# EAGLE design anemometer-r3 (EAGLE 9.2.2)
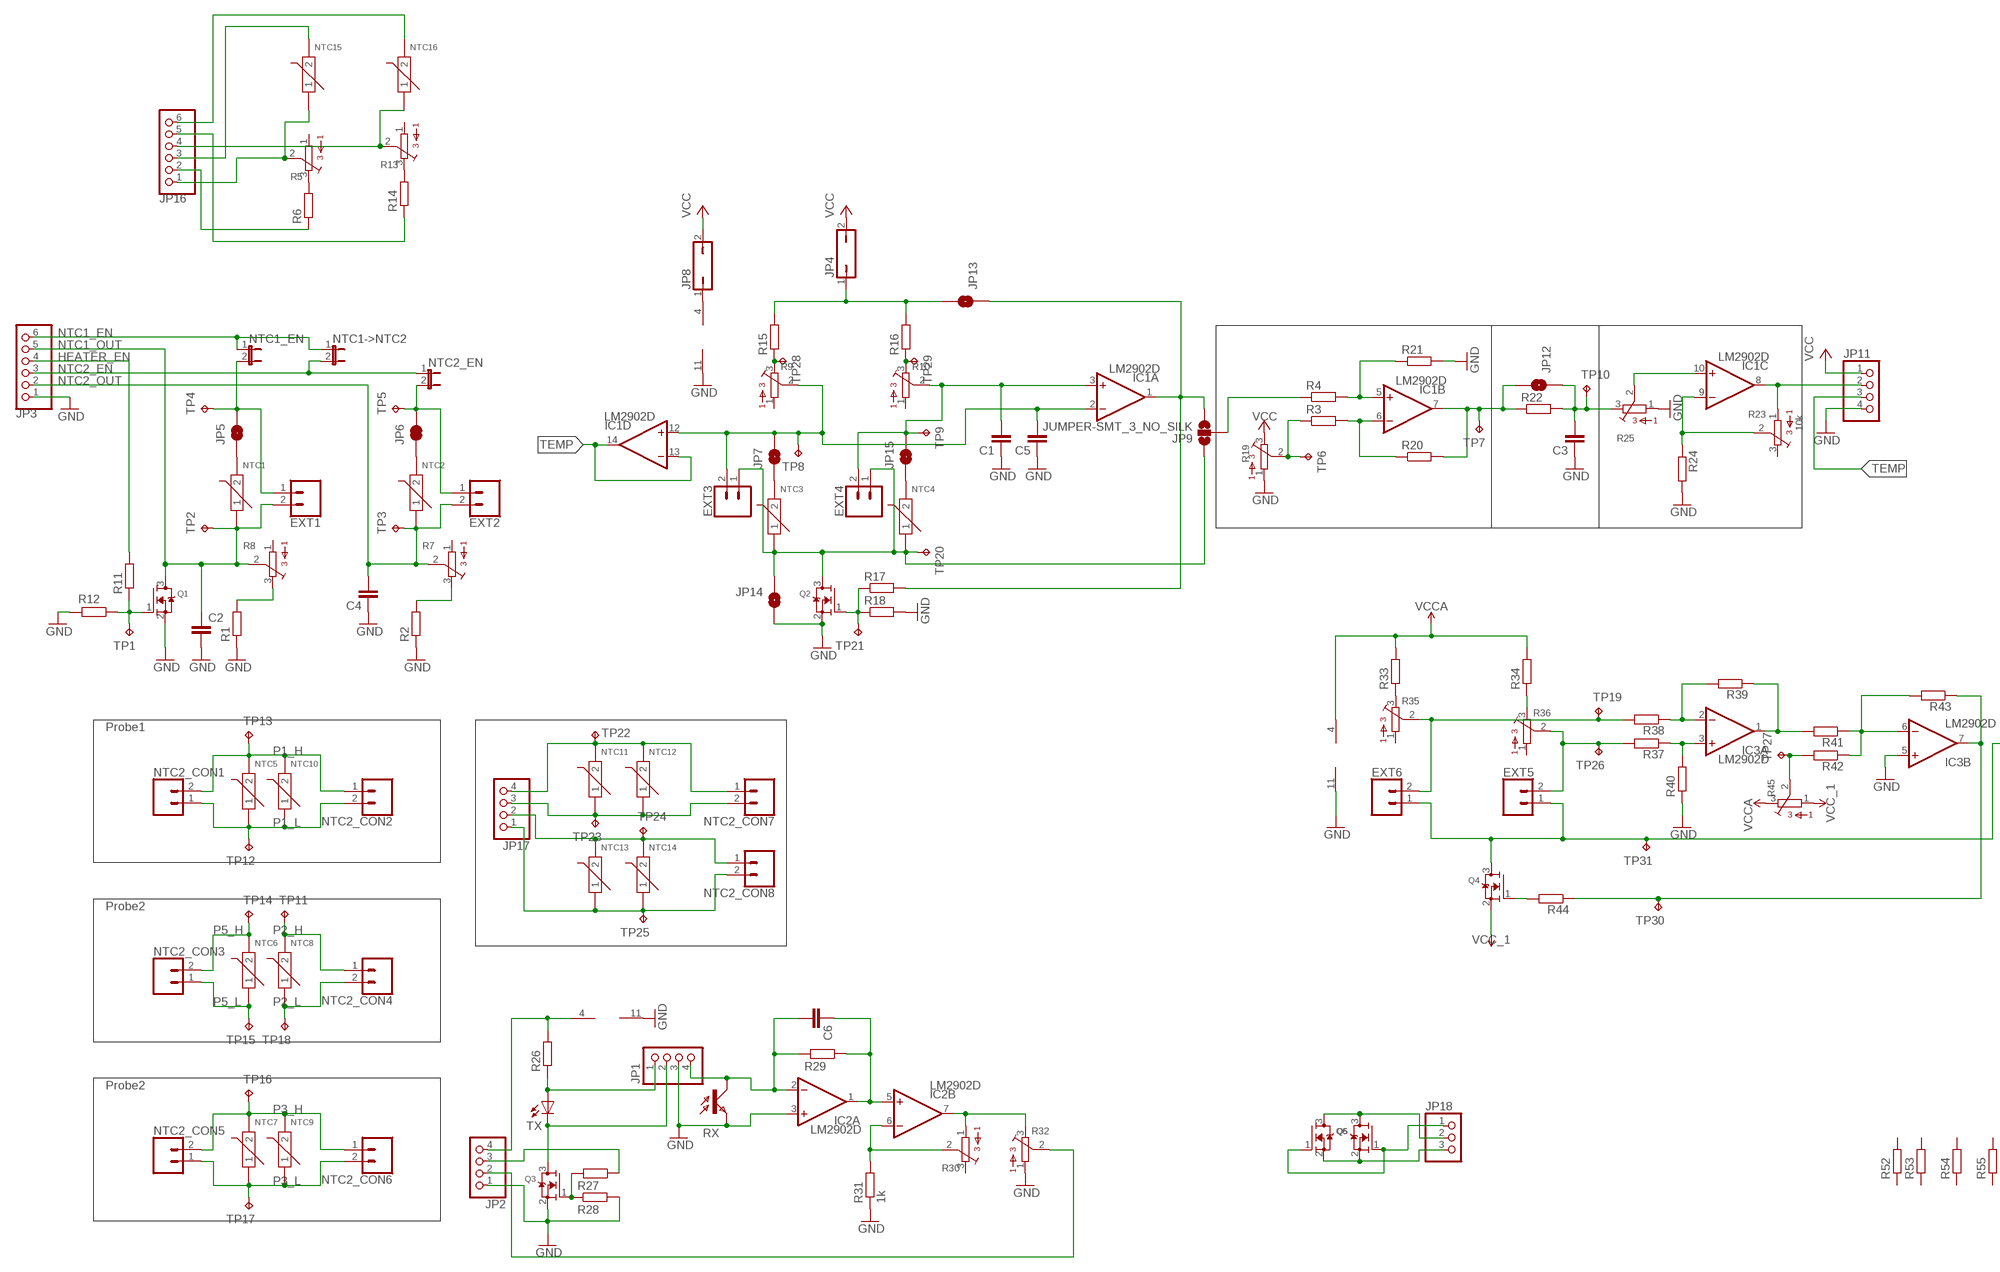
[diagram p0: schematic, sheet 1, part 1 of 2]
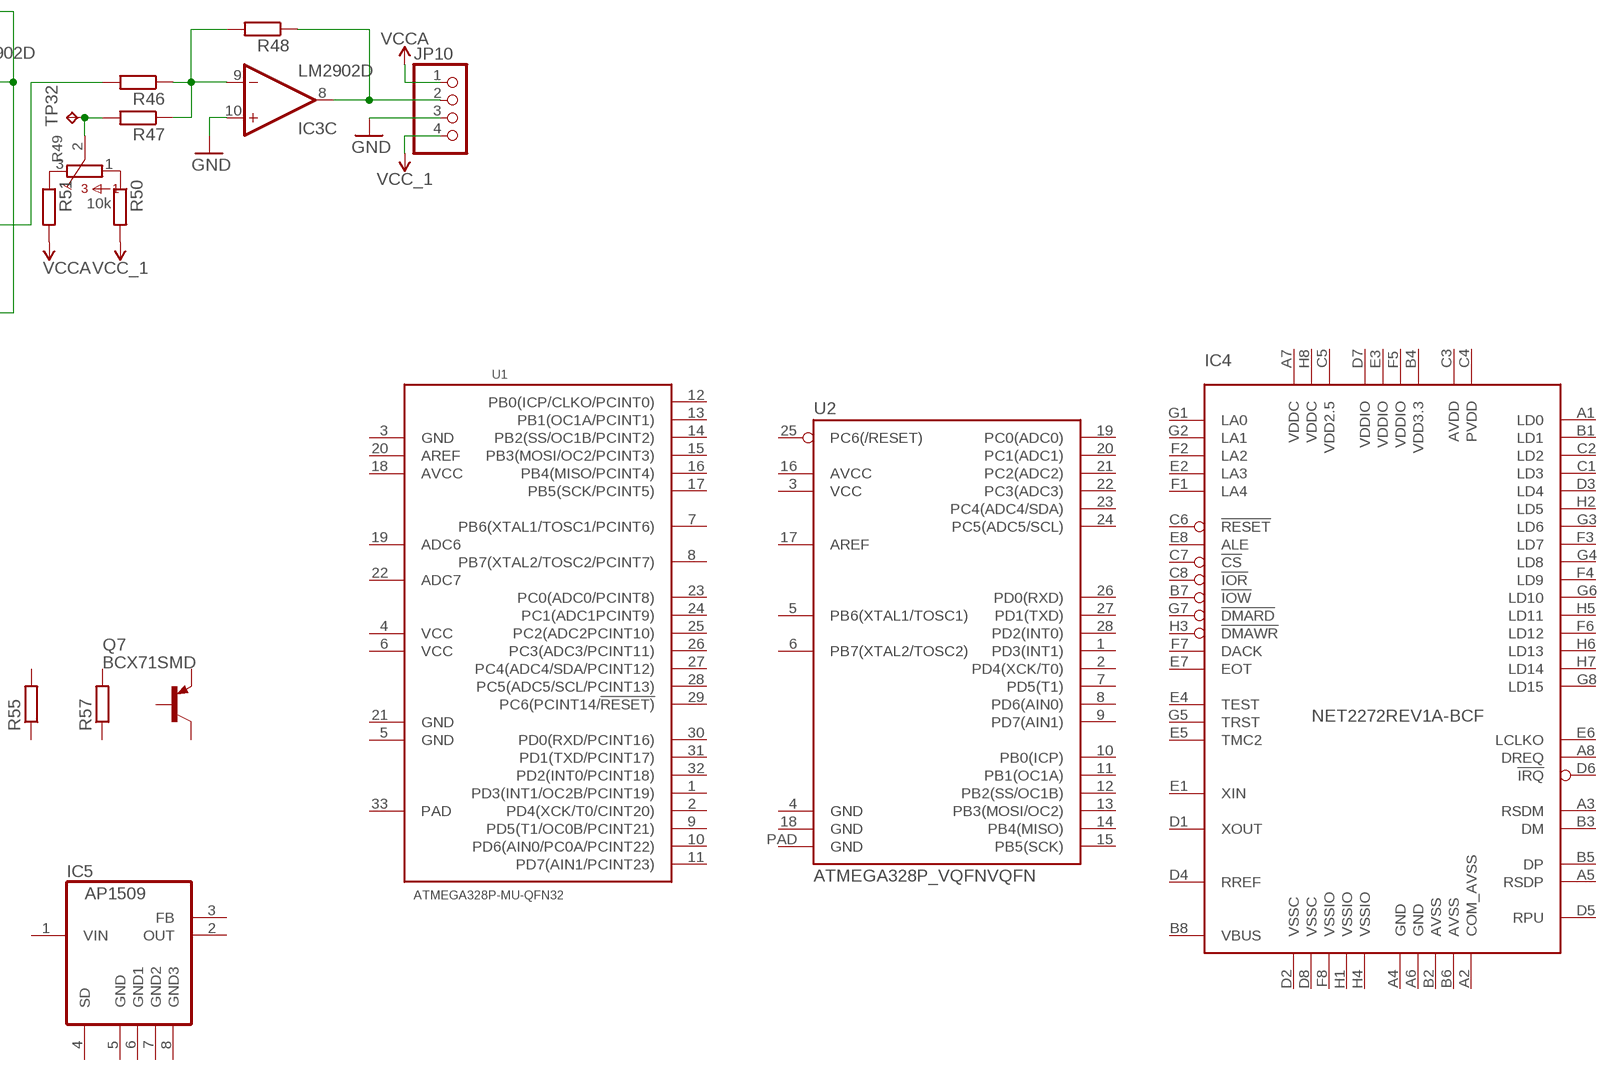
[diagram p1: schematic, sheet 1, part 2 of 2]

## Parts
C1  C-EUC0603  [C0603]
C2  C-EUC0603  [C0603]
C3  C-EUC0603  [C0603]
C4  C-EUC0603  [C0603]
C5  C-EUC0603  [C0603]
C6  C-EUC0603  [C0603]
EXT1  CONN_02  [1X02]
EXT2  CONN_02  [1X02]
EXT3  CONN_02  [1X02]
EXT4  CONN_02  [1X02]
EXT5  CONN_02  [1X02]
EXT6  CONN_02  [1X02]
IC1  LM2902D  [SO14]
IC2  LM2902D  [SO14]
IC3  LM2902D  [SO14]
IC4  NET2272REV1A-BCF  [FBGA64]
IC5  AP1509SOIC-8-TIGHT  [SO08-H]
JP1  PINHD-1X4  [1X04]
JP2  PINHD-1X4  [1X04]
JP3  PINHD-1X6  [1X06]
JP4  JP1Q  [JP1]
JP5  JUMPER-SMT_2_NC_TRACE_SILK  [SMT-JUMPER_2_NC_TRACE_SILK]
JP6  JUMPER-SMT_2_NC_TRACE_SILK  [SMT-JUMPER_2_NC_TRACE_SILK]
JP7  JUMPER-SMT_2_NC_TRACE_SILK  [SMT-JUMPER_2_NC_TRACE_SILK]
JP8  JP1Q  [JP1]
JP9  JUMPER-SMT_3_NO_SILK  [SMT-JUMPER_3_NO_SILK]
JP10  PINHD-1X4  [1X04]
JP11  PINHD-1X4  [1X04]
JP12  JUMPER-SMT_2_NO_SILK  [SMT-JUMPER_2_NO_SILK]
JP13  JUMPER-SMT_2_NO_SILK  [SMT-JUMPER_2_NO_SILK]
JP14  JUMPER-SMT_2_NO_SILK  [SMT-JUMPER_2_NO_SILK]
JP15  JUMPER-SMT_2_NC_TRACE_SILK  [SMT-JUMPER_2_NC_TRACE_SILK]
JP16  PINHD-1X6  [1X06]
JP17  PINHD-1X4  [1X04]
JP18  PINHD-1X3  [1X03]
NTC1  NCP18WF104F03RC  THERMISTOR-RES-NTC-100K(0603)  [R0603]
NTC1->NTC2  JP1E  [JP1]
NTC1_EN  JP1E  [JP1]
NTC2  NCP18WF104F03RC  THERMISTOR-RES-NTC-100K(0603)  [R0603]
NTC2_CON1  CONN_02  [1X02]
NTC2_CON2  CONN_02  [1X02]
NTC2_CON3  CONN_02  [1X02]
NTC2_CON4  CONN_02  [1X02]
NTC2_CON5  CONN_02  [1X02]
NTC2_CON6  CONN_02  [1X02]
NTC2_CON7  CONN_02  [1X02]
NTC2_CON8  CONN_02  [1X02]
NTC2_EN  JP1E  [JP1]
NTC3  NCP18WF104F03RC  THERMISTOR-RES-NTC-100K(0603)  [R0603]
NTC4  NCP18WF104F03RC  THERMISTOR-RES-NTC-100K(0603)  [R0603]
NTC5  NCP18WF104F03RC  THERMISTOR-RES-NTC-100K(0603)  [R0603]
NTC6  NCP18WF104F03RC  THERMISTOR-RES-NTC-100K(0603)  [R0603]
NTC7  NCP18WF104F03RC  THERMISTOR-RES-NTC-100K(0603)  [R0603]
NTC8  NCP18WF104F03RC  THERMISTOR-RES-NTC-100K(0603)  [R0603]
NTC9  NCP18WF104F03RC  THERMISTOR-RES-NTC-100K(0603)  [R0603]
NTC10  NCP18WF104F03RC  THERMISTOR-RES-NTC-100K(0603)  [R0603]
NTC11  NCP18WF104F03RC  THERMISTOR-RES-NTC-100K(0603)  [R0603]
NTC12  NCP18WF104F03RC  THERMISTOR-RES-NTC-100K(0603)  [R0603]
NTC13  NCP18WF104F03RC  THERMISTOR-RES-NTC-100K(0603)  [R0603]
NTC14  NCP18WF104F03RC  THERMISTOR-RES-NTC-100K(0603)  [R0603]
NTC15  NCP18WF104F03RC  THERMISTOR-RES-NTC-100K(0603)  [R0603]
NTC16  NCP18WF104F03RC  THERMISTOR-RES-NTC-100K(0603)  [R0603]
Q1  MOSFET-NREFLOW  [SOT23]
Q2  MOSFET-NREFLOW  [SOT23]
Q3  MOSFET-NREFLOW  [SOT23]
Q4  MOSFET-NREFLOW  [SOT23]
Q5  MOSFET-NREFLOW  [SOT23]
Q6  MOSFET-NREFLOW  [SOT23]
Q7  BCX71SMD  [SOT23]
R1  R-EU_R0603  [R0603]
R2  R-EU_R0603  [R0603]
R3  R-EU_R0603  [R0603]
R4  R-EU_R0603  [R0603]
R5  3362P  [3362P]
R6  R-EU_R0603  [R0603]
R7  3362P  [3362P]
R8  3362P  [3362P]
R9  3362P  [3362P]
R10  3362P  [3362P]
R11  R-EU_R0603  [R0603]
R12  R-EU_R0603  [R0603]
R13  3362P  [3362P]
R14  R-EU_R0603  [R0603]
R15  R-EU_R0603  [R0603]
R16  R-EU_R0603  [R0603]
R17  R-EU_R0603  [R0603]
R18  R-EU_R0603  [R0603]
R19  3362P  [3362P]
R20  R-EU_R0603  [R0603]
R21  R-EU_R0603  [R0603]
R22  R-EU_R0603  [R0603]
R23  10k  3362P  [3362P]
R24  R-EU_R0603  [R0603]
R25  3362P  [3362P]
R26  R-EU_R0603  [R0603]
R27  R-EU_R0603  [R0603]
R28  R-EU_R0603  [R0603]
R29  R-EU_R0603  [R0603]
R30  3362P  [3362P]
R31  1k  R-EU_R0603  [R0603]
R32  3362P  [3362P]
R33  R-EU_R0603  [R0603]
R34  R-EU_R0603  [R0603]
R35  3362P  [3362P]
R36  3362P  [3362P]
R37  R-EU_R0603  [R0603]
R38  R-EU_R0603  [R0603]
R39  R-EU_R0603  [R0603]
R40  R-EU_R0603  [R0603]
R41  R-EU_R0603  [R0603]
R42  R-EU_R0603  [R0603]
R43  R-EU_R0603  [R0603]
R44  R-EU_R0603  [R0603]
R45  3362P  [3362P]
R46  R-EU_R0603  [R0603]
R47  R-EU_R0603  [R0603]
R48  R-EU_R0603  [R0603]
R49  10k  3362P  [3362P]
R50  R-EU_R0603  [R0603]
R51  R-EU_R0603  [R0603]
R52  R-EU_R0402  [R0402]
R53  R-EU_R0603  [R0603]
R54  R-EU_R0805  [R0805]
R55  R-EU_R1206  [R1206]
R57  R-EU_R2010  [R2010]
RX  LPT80A  [LPT80A]
TP1  TPTP16R  [TP16R]
TP2  TPTP16R  [TP16R]
TP3  TPTP16R  [TP16R]
TP4  TPTP16R  [TP16R]
TP5  TPTP16R  [TP16R]
TP6  TPTP16R  [TP16R]
TP7  TPTP16R  [TP16R]
TP8  TPTP16R  [TP16R]
TP9  TPTP16R  [TP16R]
TP10  TPTP16R  [TP16R]
TP11  TPTP16R  [TP16R]
TP12  TPTP16R  [TP16R]
TP13  TPTP16R  [TP16R]
TP14  TPTP16R  [TP16R]
TP15  TPTP16R  [TP16R]
TP16  TPTP16R  [TP16R]
TP17  TPTP16R  [TP16R]
TP18  TPTP16R  [TP16R]
TP19  TPTP16R  [TP16R]
TP20  TPTP16R  [TP16R]
TP21  TPTP16R  [TP16R]
TP22  TPTP16R  [TP16R]
TP23  TPTP16R  [TP16R]
TP24  TPTP16R  [TP16R]
TP25  TPTP16R  [TP16R]
TP26  TPTP16R  [TP16R]
TP27  TPTP16R  [TP16R]
TP28  TPTP16R  [TP16R]
TP29  TPTP16R  [TP16R]
TP30  TPTP16R  [TP16R]
TP31  TPTP16R  [TP16R]
TP32  TPTP16R  [TP16R]
TX  LEDIRL80A  [IRL80A]
U1  ATMEGA328P-MU-QFN32  MCU-ATMEGA328P-MU(QFN32)  [QFN32G-0.5-5X5MM]
U2  ATMEGA328P_VQFNVQFN  [VQFN-28]

## Nets
GND: C1.1 C2.2 C3.1 C4.1 C5.1 IC1.11(P:V-) IC2.3(A:+IN) IC2.11(P:V-) IC3.5(B:+IN) IC3.10(C:+IN) IC3.11(P:V-) JP1.3 JP2.1 JP3.1 JP10.3 JP11.4 JP14.2 Q1.2(S) Q2.2(S) Q3.2(S) R1.1 R2.1 R12.2 R18.2 R19.1 R21.2 R24.2 R25.1 R28.2 R31.1 R32.1 R40.1 RX.E
HEATER_EN: JP3.4 R11.2
N$1: IC1.10(C:+IN) R25.2
N$2: R9.3 R15.1 TP28.TP
N$3: R10.3 R16.1 TP29.TP
N$4: R1.2 R8.3
N$5: JP1.1 R26.1 TX.A
N$6: JP7.1 NTC3.2
N$7: Q1.1(G) R11.1 R12.1 TP1.TP
N$8: JP16.4 NTC16.1 R13.2
N$9: R2.2 R7.3
N$10: JP1.2 Q3.3(D) TX.K(C)
N$11: EXT3.1 EXT4.1 JP9.1 JP14.1 NTC3.1 NTC4.1 Q2.3(D) TP20.TP
N$12: Q2.1(G) R17.1 R18.1 TP21.TP
N$13: IC1.1(A:OUT) JP9.3 JP13.1 R17.2
N$14: IC1.5(B:+IN) R4.2 R21.1
N$15: C3.2 JP12.1 R22.2 R25.3 TP10.TP
N$16: IC1.6(B:-IN) R3.2 R20.1
N$17: R3.1 R19.2 TP6.TP
N$18: IC1.9(C:-IN) R23.2 R24.1
N$19: C5.2 EXT3.2 IC1.2(A:-IN) IC1.12(D:+IN) JP7.2 R9.2 TP8.TP
N$20: IC1.8(C:OUT) JP11.2 R23.1
N$21: C1.2 EXT4.2 IC1.3(A:+IN) JP15.2 R10.2 TP9.TP
N$22: JP5.1 NTC1.2
N$23: JP6.1 NTC2.2
N$24: IC2.4(P:V+) JP2.4 R26.2
N$25: IC1.4(P:V+) JP8.1
N$26: JP17.4 NTC2_CON7.1 NTC11.2 NTC12.2 TP22.TP
N$27: JP4.1 JP13.2 R15.2 R16.2
N$28: IC1.7(B:OUT) JP12.2 R20.2 R22.1 TP7.TP
N$29: EXT2.1 JP6.2 NTC2_EN.2 TP5.TP
N$30: JP17.3 NTC2_CON7.2 NTC11.1 NTC12.1 TP23.TP
N$31: EXT1.1 JP5.2 NTC1_EN.2 TP4.TP
N$32: JP15.1 NTC4.2
N$33: JP17.2 NTC2_CON8.1 NTC13.2 NTC14.2 TP24.TP
N$34: JP17.1 NTC2_CON8.2 NTC13.1 NTC14.1 TP25.TP
N$35: R33.1 R35.3
N$36: JP16.6 NTC16.2
N$37: JP16.3 NTC15.2
N$38: Q3.1(G) R27.2 R28.1
N$39: JP2.3 R27.1
N$40: R5.3 R6.2
N$41: R13.3 R14.2
N$42: JP16.1 NTC15.1 R5.2
N$43: C6.1 IC2.1(A:OUT) IC2.5(B:+IN) R29.1
N$44: JP16.2 R6.1
N$45: JP16.5 R14.1
N$46: C6.2 IC2.2(A:-IN) JP1.4 R29.2 RX.C
N$47: IC2.6(B:-IN) R30.2 R31.2
N$48: IC2.7(B:OUT) R30.1 R32.3
N$49: JP2.2 R32.2
N$50: R34.1 R36.3
N$51: JP9.2 R4.1
N$52: EXT6.2 R35.2 R38.2 TP19.TP
N$53: EXT5.2 R36.2 R37.2 TP26.TP
N$54: EXT5.1 EXT6.1 Q4.3(D) R46.2 TP31.TP
N$55: IC3.3(A:+IN) R37.1 R40.2
N$56: IC3.2(A:-IN) R38.1 R39.2
N$57: IC3.6(B:-IN) R41.1 R42.1 R43.2
N$58: IC3.1(A:OUT) R39.1 R41.2
N$59: Q4.1(G) R44.2
N$60: IC3.7(B:OUT) R43.1 R44.1 TP30.TP
N$61: R49.1 R50.1
N$62: R42.2 R45.2 TP27.TP
N$63: IC3.9(C:-IN) R46.1 R47.1 R48.2
N$64: R49.3 R51.1
N$65: JP18.2 Q5.3(D) Q6.3(D)
N$66: R47.2 R49.2 TP32.TP
N$67: IC3.8(C:OUT) JP10.2 R48.1
N$68: JP18.3 Q5.2(S) Q6.2(S)
N$69: JP18.1 Q5.1(G) Q6.1(G)
NTC1_EN: JP3.6 NTC1->NTC2.1 NTC1_EN.1
NTC1_OUT: C2.1 EXT1.2 JP3.5 NTC1.1 Q1.3(D) R8.2 TP2.TP
NTC2_EN: JP3.3 NTC1->NTC2.2 NTC2_EN.1
NTC2_OUT: C4.2 EXT2.2 JP3.2 NTC2.1 R7.2 TP3.TP
P1_H: NTC2_CON1.2 NTC2_CON2.1 NTC5.2 NTC10.2 TP13.TP
P1_L: NTC2_CON1.1 NTC2_CON2.2 NTC5.1 NTC10.1 TP12.TP
P2_H: NTC2_CON4.1 NTC8.2 TP11.TP
P2_L: NTC2_CON4.2 NTC8.1 TP18.TP
P3_H: NTC2_CON5.2 NTC2_CON6.1 NTC7.2 NTC9.2 TP16.TP
P3_L: NTC2_CON5.1 NTC2_CON6.2 NTC7.1 NTC9.1 TP17.TP
P5_H: NTC2_CON3.2 NTC6.2 TP14.TP
P5_L: NTC2_CON3.1 NTC6.1 TP15.TP
TEMP: IC1.13(D:-IN) IC1.14(D:OUT) JP11.3
VCC: JP4.2 JP8.2 JP11.1 R19.3
VCC_1: JP10.4 Q4.2(S) R45.1 R50.2
VCCA: IC3.4(P:V+) JP10.1 R33.2 R34.2 R45.3 R51.2
Unconnected: IC2.8(C:OUT) IC2.9(C:-IN) IC2.10(C:+IN) IC2.12(D:+IN) IC2.13(D:-IN) IC2.14(D:OUT) IC3.12(D:+IN) IC3.13(D:-IN) IC3.14(D:OUT) IC4.A1(LD0) IC4.A3(RSDM) IC4.A5(RSDP) IC4.A8(DREQ) IC4.B1(LD1) IC4.B3(DM) IC4.B5(DP) IC4.B7(!IOW) IC4.B8(VBUS) IC4.C1(LD3) IC4.C2(LD2) IC4.C6(!RESET) IC4.C7(!CS) IC4.C8(!IOR) IC4.D1(XOUT) IC4.D3(LD4) IC4.D4(RREF) IC4.D5(RPU) IC4.D6(!IRQ) IC4.E1(XIN) IC4.E2(LA3) IC4.E4(TEST) IC4.E5(TMC2) IC4.E6(LCLKO) IC4.E7(EOT) IC4.E8(ALE) IC4.F1(LA4) IC4.F2(LA2) IC4.F3(LD7) IC4.F4(LD9) IC4.F6(LD12) IC4.F7(DACK) IC4.G1(LA0) IC4.G2(LA1) IC4.G3(LD6) IC4.G4(LD8) IC4.G5(TRST) IC4.G6(LD10) IC4.G7(!DMARD) IC4.G8(LD15) IC4.H2(LD5) IC4.H3(!DMAWR) IC4.H5(LD11) IC4.H6(LD13) IC4.H7(LD14) IC5.1(VIN) IC5.4(SD) IC5.6(GND1) IC5.7(GND2) Q7.1(B) Q7.2(E) Q7.3(C) R5.1 R7.1 R8.1 R9.1 R10.1 R13.1 R23.3 R30.3 R35.1 R36.1 R52.1 R52.2 R53.1 R53.2 R54.1 R54.2 R55.1 R55.2 R57.1 R57.2 U1.1(PD3(INT1/OC2B/PCINT19)) U1.2(PD4(XCK/T0/CINT20)) U1.3(GND) U1.4(VCC) U1.5(GND) U1.6(VCC) U1.7(PB6(XTAL1/TOSC1/PCINT6)) U1.8(PB7(XTAL2/TOSC2/PCINT7)) U1.9(PD5(T1/OC0B/PCINT21)) U1.10(PD6(AIN0/PC0A/PCINT22)) U1.11(PD7(AIN1/PCINT23)) U1.12(PB0(ICP/CLKO/PCINT0)) U1.13(PB1(OC1A/PCINT1)) U1.14(PB2(SS/OC1B/PCINT2)) U1.15(PB3(MOSI/OC2/PCINT3)) U1.16(PB4(MISO/PCINT4)) U1.17(PB5(SCK/PCINT5)) U1.18(AVCC) U1.19(ADC6) U1.20(AREF) U1.21(GND) U1.22(ADC7) U1.23(PC0(ADC0/PCINT8)) U1.24(PC1(ADC1PCINT9)) U1.25(PC2(ADC2PCINT10)) U1.26(PC3(ADC3/PCINT11)) U1.27(PC4(ADC4/SDA/PCINT12)) U1.28(PC5(ADC5/SCL/PCINT13)) U1.29(PC6(PCINT14/!RESET)) U1.30(PD0(RXD/PCINT16)) U1.31(PD1(TXD/PCINT17)) U1.32(PD2(INT0/PCINT18)) U1.33(PAD) U2.1(PD3(INT1)) U2.2(PD4(XCK/T0)) U2.3(VCC) U2.4(GND) U2.5(PB6(XTAL1/TOSC1)) U2.6(PB7(XTAL2/TOSC2)) U2.7(PD5(T1)) U2.8(PD6(AIN0)) U2.9(PD7(AIN1)) U2.10(PB0(ICP)) U2.11(PB1(OC1A)) U2.12(PB2(SS/OC1B)) U2.13(PB3(MOSI/OC2)) U2.14(PB4(MISO)) U2.15(PB5(SCK)) U2.16(AVCC) U2.17(AREF) U2.18(GND) U2.19(PC0(ADC0)) U2.20(PC1(ADC1)) U2.21(PC2(ADC2)) U2.22(PC3(ADC3)) U2.23(PC4(ADC4/SDA)) U2.24(PC5(ADC5/SCL)) U2.25(PC6(/RESET)) U2.26(PD0(RXD)) U2.27(PD1(TXD)) U2.28(PD2(INT0)) U2.PAD(GND)

## Notes on the sheet
- Probe1
- Probe2
- Probe2

## Power pins joined to a net without a drawn wire
AVDD: IC4.C3(AVDD)
AVSS: IC4.B2(AVSS) IC4.B6(AVSS)
COM_AVSS: IC4.A2(COM_AVSS)
FB: IC5.3(FB)
GND: IC4.A4(GND) IC4.A6(GND) IC5.5(GND)
GND3: IC5.8(GND3)
OUT: IC5.2(OUT)
PVDD: IC4.C4(PVDD)
VDD2.5: IC4.C5(VDD2.5)
VDD3.3: IC4.B4(VDD3.3)
VDDC: IC4.A7(VDDC) IC4.H8(VDDC)
VDDIO: IC4.D7(VDDIO) IC4.E3(VDDIO) IC4.F5(VDDIO)
VSSC: IC4.D2(VSSC) IC4.D8(VSSC)
VSSIO: IC4.F8(VSSIO) IC4.H1(VSSIO) IC4.H4(VSSIO)

## Library data of the parts
C1-C6 = rcl:C-EU: CAPACITOR, European symbol; SPICEPREFIX: C
EXT1-EXT6 NTC2_CON1-NTC2_CON8 = SparkFun-Connectors:CONN_02: Multi connection point. Often used as Generic Header-pin footprint for 0.1 inch spaced/style header connections On any of the 0.1 inch spaced packages, you can populate with these: Break Away Headers - Straight <https://www.sparkfun.com/products/116> (PRT-00116) Break Away Male Headers - Right Angle <https://www.sparkfun.com/products/553> (PRT-00553) Female Headers <https://www.sparkfun.com/products/115> (PRT-00115) Break Away Headers - Machine Pin <https://www.sparkfun.com/products/117> (PRT-00117) Break Away Female Headers - Swiss Machine Pin <https://www.sparkfun.com/products/743> (PRT-00743) For SCREWTERMINALS and SPRING TERMINALS visit here: Screw Terimnals on SparkFun.com <https://www.sparkfun.com/search/results?term=Screw+Terminals> (5mm/3.5mm/2.54mm spacing) This device is also useful as a general connection point to wire up your design to another part of your project. Our various solder wires solder well into these plated through hole pads. Hook-Up Wire - Assortment (Stranded, 22 AWG) <https://www.sparkfun.com/products/11375> (PRT-11375) Hook-Up Wire - Assortment (Solid Core, 22 AWG) <https://www.sparkfun.com/products/11367> (PRT-11367) View the entire wire category on our website here <https://www.sparkfun.com/categories/141> Special notes: Molex polarized connector foot print use with: PRT-08233 with associated crimp pins and housings. 2.54_SCREWTERM for use with PRT-10571. 3.5mm Screw Terminal footprints for PRT-08084 5mm Screw Terminal footprints for use with PRT-08432
IC1-IC3 = linear:LM2902: Low power quad operational amplifier Source: Data sgeet <http://www.st.com/internet/com/TECHNICAL_RESOURCES/TECHNICAL_LITERATURE/DATASHEET/CD00000533.pdf>
IC4 = plxtech:NET2272: NET2272 USB 2.0 Peripheral Controller Source: http://www.plxtech.com/dts/download.asp?f=NET2000/2272/Net2272.spec.re040615.pdf FBGA-Type: http://www1.plxtech.com/TEMP/77131/NET2272r1A_data_book_v1.92_31Oct05.pdf; OC_FARNELL: unknown; OC_NEWARK: unknown
IC5 = BeagleBone_Blue_R3:AP1509: 150KHz, 2A PWM BUCK DC/DC CONVERTER
JP1 JP2 JP10 JP11 JP17 = pinhead:PINHD-1X4: PIN HEADER
JP3 JP16 = adafruit:PINHD-1X6: PIN HEADER
JP4 JP8 = jumper:JP1Q: JUMPER
JP5-JP7 JP15 = SparkFun-Jumpers:JUMPER-SMT_2_NC_TRACE: Normally closed trace jumper This jumper has a trace between two pads so it's normally closed (NC). Use a razor knife to open the connection. For best results follow the IPC guidelines for cutting traces: Cutout at least 0.063 mm (0.005 in). Remove all loose material to clean up the cut area. Seal the cut with an approved epoxy. Reapply solder to reclose the connection.
JP9 = SparkFun-Jumpers:JUMPER-SMT_3_NO: Normally open jumper This jumper has three pads in close proximity to each other. Apply solder to close the connection(s).
JP12-JP14 = SparkFun-Jumpers:JUMPER-SMT_2_NO: Normally open jumper This jumper has two pads in close proximity to each other. Apply solder to close the connection. Round pads are easier to solder for beginners, but are a lot larger. SparkFun Product that uses the round pads: SparkFun EL Sequencer <https://www.sparkfun.com/products/12781>
JP18 = adafruit:PINHD-1X3: PIN HEADER
NTC1-NTC16 = Seeed-Resistor:THERMISTOR-RES-NTC-100K(0603): 314110001; MPN: NCP18WF104F03RC
NTC1->NTC2 NTC1_EN NTC2_EN = jumper:JP1E: JUMPER
Q1-Q6 = adafruit:MOSFET-N: N-Channel Mosfet 2N7002E - 60V 260mA SOT23 [Digikey: 2N7002ET1GOSTR-ND] - REEL BSH103 - 30V 850mA SOT23 [Digikey: 568-5013-1-ND]
Q7 = transistor-pnp:BCX71SMD: PNP Transistor
R1-R4 R6 R11 R12 R14-R18 R20-R22 R24 R26-R29 R31 R33 R34 R37-R44 R46-R48 R50-R55 R57 = resistor:R-EU_: RESISTOR, European symbol
R5 R7-R10 R13 R19 R23 R25 R30 R32 R35 R36 R45 R49 = bourns:3362: 3362 Series 1/4" Square Trimmer
RX = opto-trans-siemens:LPT80A: PHOTO TRANSISTOR; OC_FARNELL: unknown; OC_NEWARK: unknown
TP1-TP32 = testpad:TP: Test pad
TX = adafruit:LED: LED OSRAM: - CHIPLED LG R971, LG N971, LY N971, LG Q971, LY Q971, LO R971, LY R971 LH N974, LH R974 LS Q976, LO Q976, LY Q976 LO Q996 - Hyper CHIPLED LW Q18S LB Q993, LB Q99A, LB R99A - SideLED LS A670, LO A670, LY A670, LG A670, LP A670 LB A673, LV A673, LT A673, LW A673 LH A674 LY A675 LS A676, LA A676, LO A676, LY A676, LW A676 LS A679, LY A679, LG A679 - Hyper Micro SIDELED® LS Y876, LA Y876, LO Y876, LY Y876 LT Y87S - SmartLED LW L88C, LW L88S LB L89C, LB L89S, LG L890 LS L89K, LO L89K, LY L89K LS L896, LA L896, LO L896, LY L896 - TOPLED LS T670, LO T670, LY T670, LG T670, LP T670 LSG T670, LSP T670, LSY T670, LOP T670, LYG T670 LG T671, LOG T671, LSG T671 LB T673, LV T673, LT T673, LW T673 LH T674 LS T676, LA T676, LO T676, LY T676, LB T676, LH T676, LSB T676, LW T676 LB T67C, LV T67C, LT T67C, LS T67K, LO T67K, LY T67K, LW E67C LS E67B, LA E67B, LO E67B, LY E67B, LB E67C, LV E67C, LT E67C LW T67C LS T679, LY T679, LG T679 LS T770, LO T770, LY T770, LG T770, LP T770 LB T773, LV T773, LT T773, LW T773 LH T774 LS E675, LA E675, LY E675, LS T675 LS T776, LA T776, LO T776, LY T776, LB T776 LHGB T686 LT T68C, LB T68C - Hyper Mini TOPLED® LB M676 - Mini TOPLED Santana® LG M470 LS M47K, LO M47K, LY M47K Source: http://www.osram.convergy.de/
U1 = Seeed-IC:MCU-ATMEGA328P-MU(QFN32): 310010005; MPN: ATMEGA328P-MU
U2 = SparkFun-IC-Microcontroller:ATMEGA328P_VQFN: Atmel 328P QFN part not in catalog

## Board
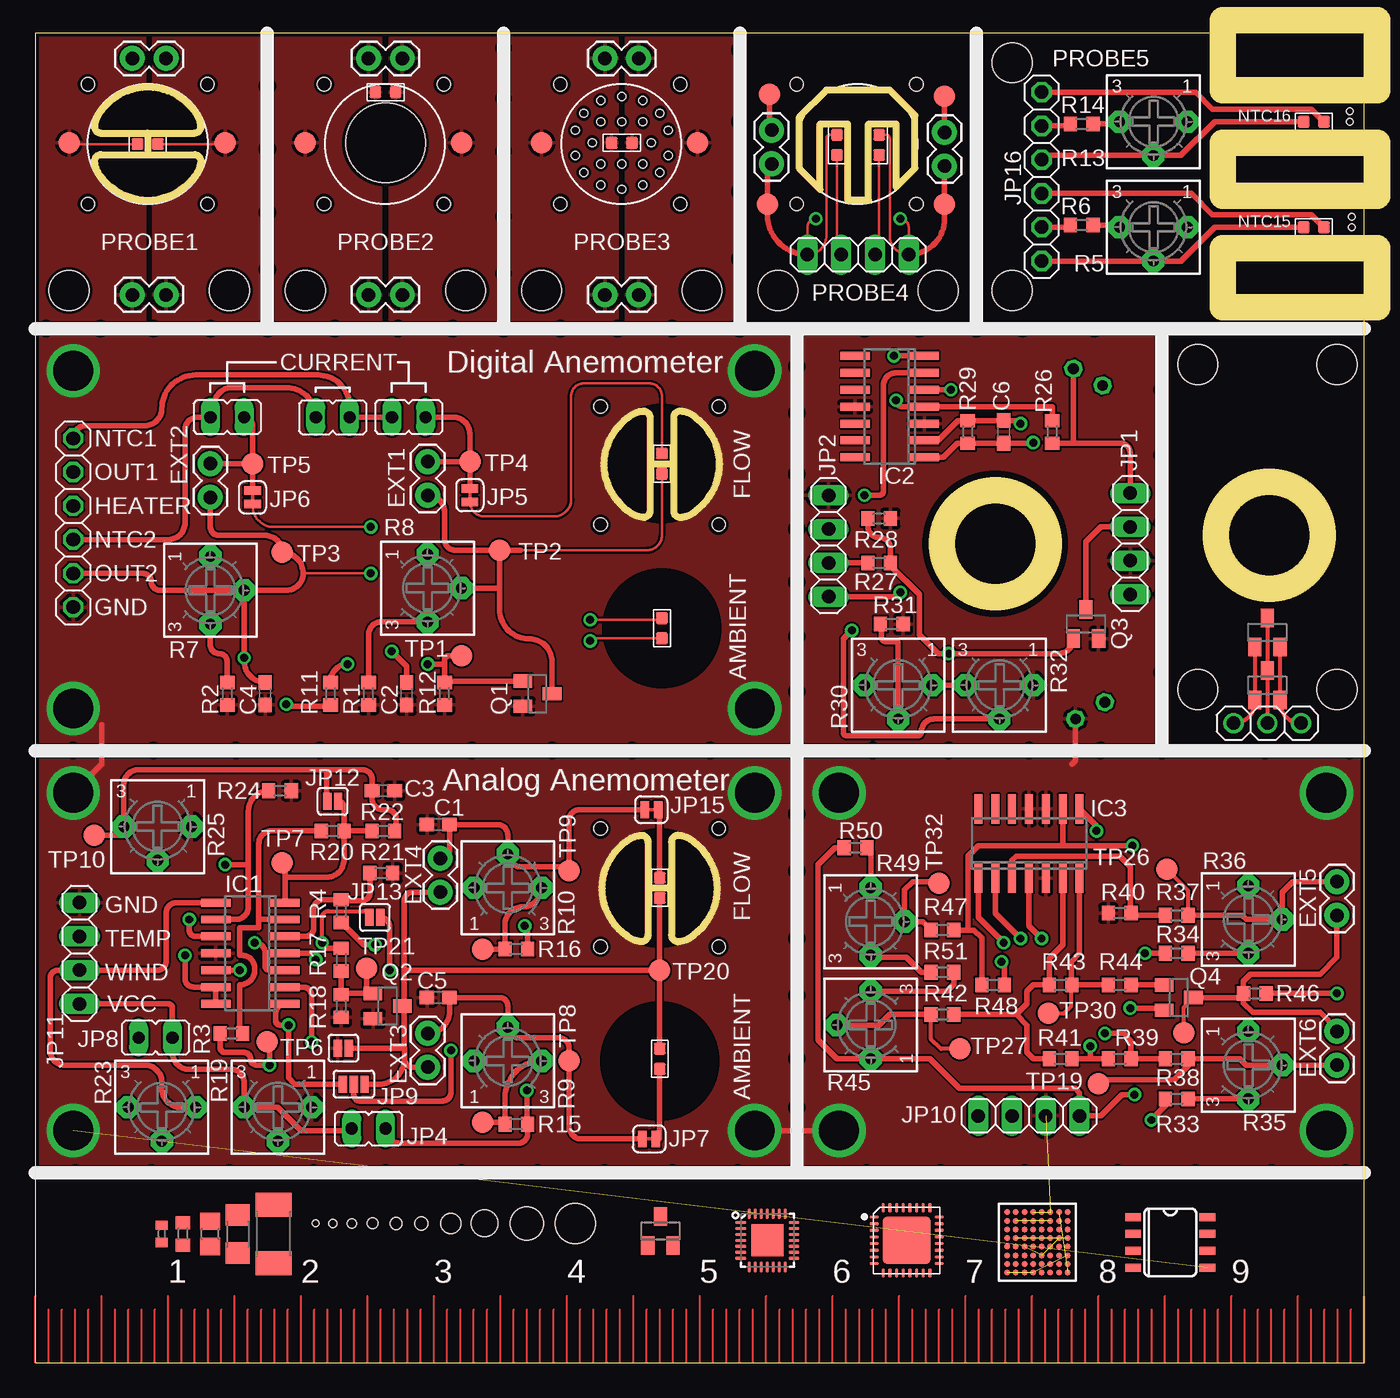
[diagram p2: board, top side]
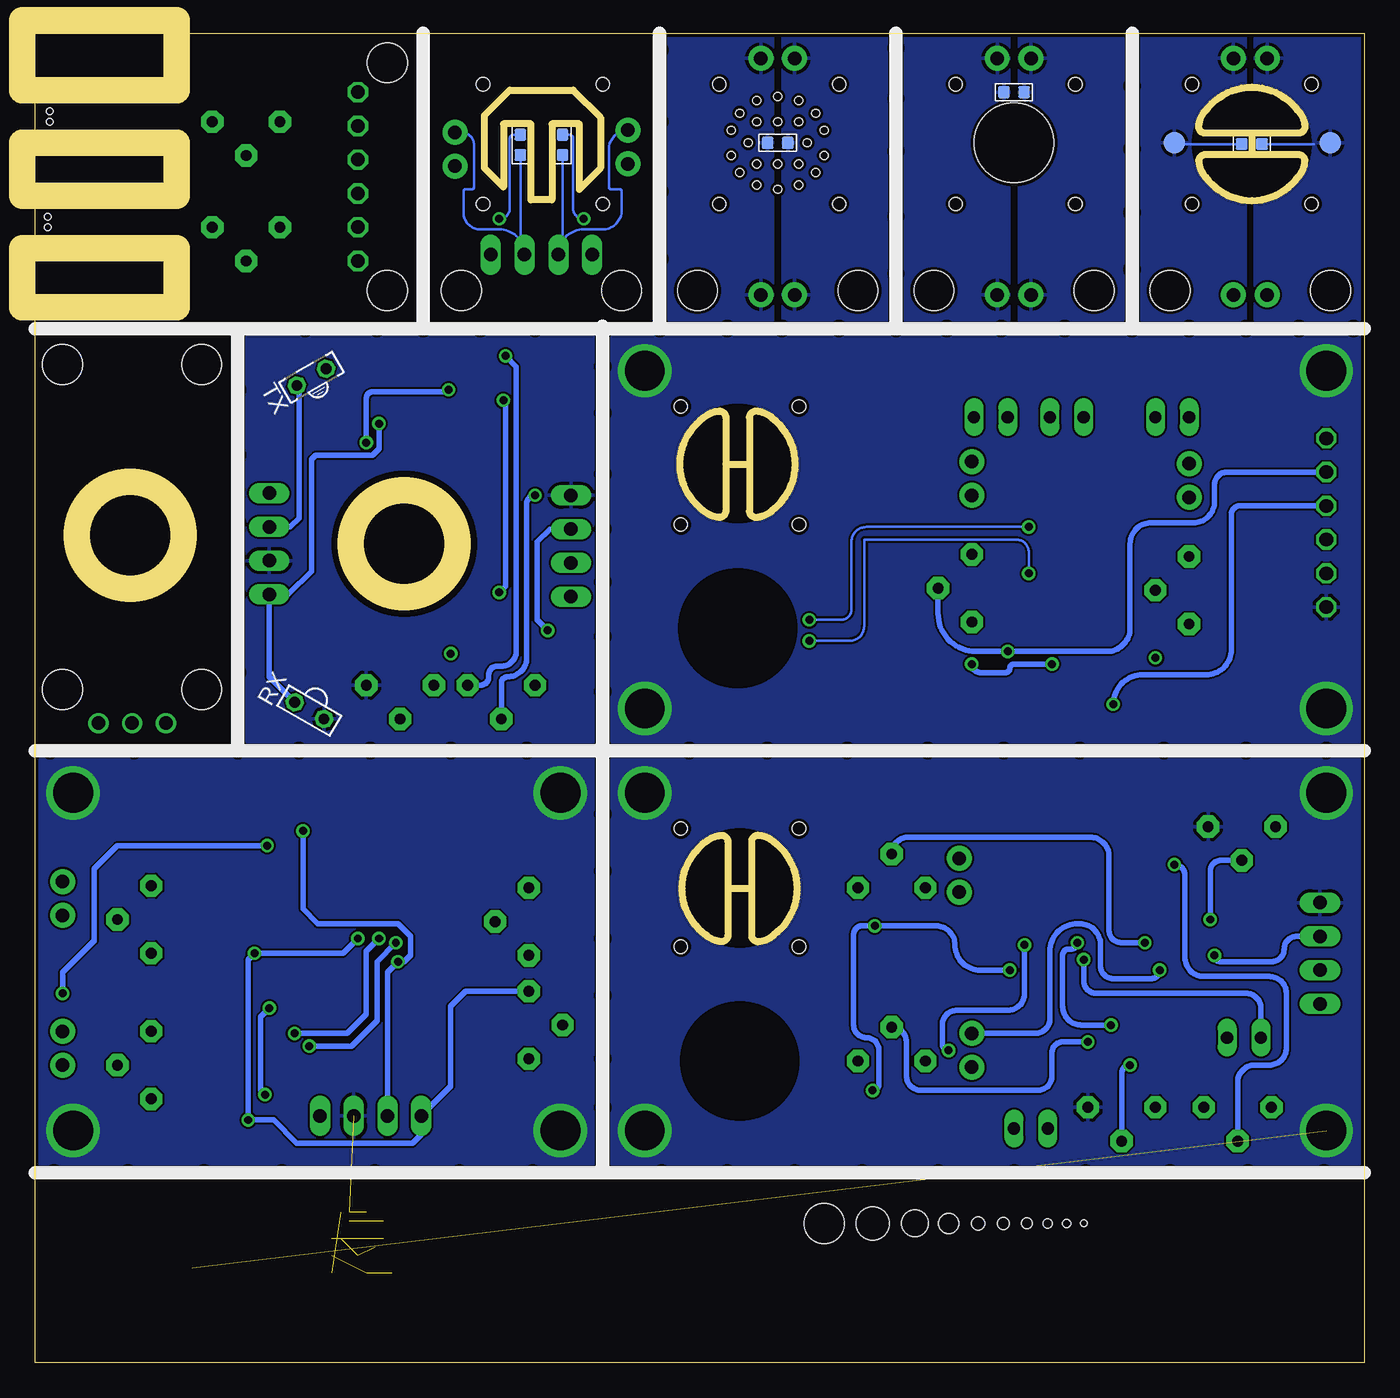
[diagram p3: board, bottom side, seen from below]

Size 100 x 100 mm. Coordinates in mm from the lower left corner, seen from the top.
Outline: 0,0 100,0 100,100 0,100 0,0
Copper layers (1*16): Top 0.035mm / dielectric 1.5mm / Bottom 0.035mm
Design rules "default *": minimum track width 6mil, minimum drill 0.35mm, track to track 6mil, track to pad 6mil, pad to pad 6mil, via to via 6mil, smd to smd 6mil, copper to edge 10mil, drill to drill 6mil, minimum pad ring 10mil, minimum via ring 8mil, stop-mask expansion 4mil, vias tented up to drill 30mil, thermal gap 10mil
Holes 1 mm at 3.96,96.17 12.96,87.17 12.96,96.17 3.96,87.17 21.74,96.17 21.74,87.17 30.74,96.17 30.74,87.17 39.52,96.17 39.52,87.17 48.52,96.17 48.52,87.17 42.54,63.03 51.43,63.03 51.43,71.92 42.54,71.92 51.43,31.29 51.43,40.17 42.54,31.29 42.54,40.17 57.3,96.17 57.3,87.17 66.3,96.17 66.3,87.17 29.05,10.48
Holes 3 mm at 2.54,80.64 14.61,80.64 20.32,80.64 32.38,80.64 38.1,80.64 50.16,80.64 55.88,80.64 67.94,80.64 73.5,97.79 73.5,80.64 87.47,75.09 97.95,75.09 87.47,50.64 97.95,50.64 40.64,10.48
Holes 6 mm at 26.35,91.76
Holes 0.6 mm at 40.64,92.71 41.91,91.76 40.64,90.81 41.27,89.53 42.55,90.17 42.55,88.58 44.13,88.27 44.13,90.17 45.72,90.17 45.72,88.58 46.99,89.53 47.62,90.81 46.35,91.76 47.62,92.71 46.99,93.98 45.72,93.34 44.13,93.34 42.55,93.34 41.27,93.98 42.55,94.93 44.13,95.25 45.72,94.93 22.38,10.48
Holes 0.5 mm at 98.9,94.14 99.06,85.41 99.06,86.2 98.9,93.34 21.11,10.48
Holes 0.8 mm at 2.86,46.04 8.89,46.04 15.08,46.04 21.43,46.04 27.15,46.04 32.86,46.04 38.89,46.04 44.93,46.04 50.8,46.04 57.31,46.04 63.02,46.04 68.74,46.04 74.77,46.04 80.17,46.04 84.77,46.04 92.55,46.04 98.9,46.04 84.77,51.91 84.77,57.78 84.77,63.18 84.77,68.26 84.77,73.18 84.77,77.79 79.69,77.79 90.96,77.79 96.36,77.79 74.3,77.79 70.8,77.79 70.8,83.03 70.8,88.27 70.8,93.66 70.8,98.9 53.02,98.74 53.02,93.34 53.02,88.11 53.02,83.03 53.02,77.79 57.31,77.79 62.39,77.79 66.52,77.79 47.94,77.79 43.81,77.79 39.53,77.79 35.24,77.79 35.24,81.92 35.24,86.2 35.24,91.12 35.24,95.09 35.24,98.9 31.43,77.79 27.3,77.79 22.54,77.79 17.46,77.79 17.46,82.23 17.46,86.52 17.46,91.28 17.46,96.04 13.18,77.79 8.89,77.79 4.92,77.79 0.79,77.79 57.31,50.48 57.31,54.61 57.31,58.74 57.31,62.71 57.31,66.83 57.31,71.44 57.31,74.93 57.31,41.27 57.31,36.99 57.31,31.91 57.31,27.62 57.31,22.86 57.31,19.21 57.31,14.29 52.86,14.29 47.94,14.29 42.86,14.29 37.78,14.29 32.07,14.29 26.35,14.29 20.95,14.29 14.61,14.29 8.73,14.29 3.02,14.29 62.55,14.29 68.1,14.29 74.45,14.29 81.44,14.29 87.31,14.29 93.03,14.29 98.58,14.29 25.4,10.48
Holes 0.7 mm at 23.81,10.48
Holes 0.9 mm at 27.15,10.48
Holes 1.5 mm at 31.27,10.48
Holes 2 mm at 33.81,10.48
Holes 2.5 mm at 36.99,10.48
tRestrict: area 4,87.2 to 13,96.2; area 42.6,63.1 to 51.6,72.1; area 42.6,50.7 to 51.6,59.7; area 42.5,31.2 to 51.5,40.2; area 42.5,18.2 to 51.5,27.2; area 67.2,56.5 to 77.3,66.7
bRestrict: area 42.6,63.1 to 51.6,72.1; area 42.6,50.7 to 51.6,59.7; area 4,87.2 to 13,96.2; area 42.5,31.2 to 51.5,40.2; area 42.5,18.2 to 51.5,27.2; area 67.2,56.5 to 77.3,66.7
Milling: area 68.2,57.6 to 76.2,65.6; area 88.9,58.2 to 96.9,66.2; 78 lines

### Footprints (pad centres in the part's own frame; a part is rotated, then mirrored left to right if it is on the bottom)
C0603 = smd 1.1 x 1: 1 -0.85,0; 2 0.85,0
1X02 = drill 1.016 pad 1.88: 1 0,0; 2 2.54,0
SO14 = smd 0.6 x 2.2: 1 -3.81,-2.6; 2 -2.54,-2.6; 3 -1.27,-2.6; 4 0,-2.6; 5 1.27,-2.6; 6 2.54,-2.6; 7 3.81,-2.6; 8 3.81,2.6; 9 2.54,2.6; 10 1.27,2.6; 11 0,2.6; 12 -1.27,2.6; 13 -2.54,2.6; 14 -3.81,2.6
FBGA64 = smd 0.45 x 0.45: A1 -2.275,2.275; A2 -1.625,2.275; A3 -0.975,2.275; A4 -0.325,2.275; A5 0.325,2.275; A6 0.975,2.275; A7 1.625,2.275; A8 2.275,2.275; B1 -2.275,1.625; B2 -1.625,1.625; B3 -0.975,1.625; B4 -0.325,1.625; B5 0.325,1.625; B6 0.975,1.625; B7 1.625,1.625; B8 2.275,1.625; C1 -2.275,0.975; C2 -1.625,0.975; C3 -0.975,0.975; C4 -0.325,0.975; C5 0.325,0.975; C6 0.975,0.975; C7 1.625,0.975; C8 2.275,0.975; D1 -2.275,0.325; D2 -1.625,0.325; D3 -0.975,0.325; D4 -0.325,0.325; D5 0.325,0.325; D6 0.975,0.325; D7 1.625,0.325; D8 2.275,0.325; E1 -2.275,-0.325; E2 -1.625,-0.325; E3 -0.975,-0.325; E4 -0.325,-0.325; E5 0.325,-0.325; E6 0.975,-0.325; E7 1.625,-0.325; E8 2.275,-0.325; F1 -2.275,-0.975; F2 -1.625,-0.975; F3 -0.975,-0.975; F4 -0.325,-0.975; F5 0.325,-0.975; F6 0.975,-0.975; F7 1.625,-0.975; F8 2.275,-0.975; G1 -2.275,-1.625; G2 -1.625,-1.625; G3 -0.975,-1.625; G4 -0.325,-1.625; G5 0.325,-1.625; G6 0.975,-1.625; G7 1.625,-1.625; G8 2.275,-1.625; H1 -2.275,-2.275; H2 -1.625,-2.275; H3 -0.975,-2.275; H4 -0.325,-2.275; H5 0.325,-2.275; H6 0.975,-2.275; H7 1.625,-2.275; H8 2.275,-2.275
SO08-H = smd 0.6 x 1.2: 1 -1.905,-2.8; 2 -0.635,-2.8; 3 0.635,-2.8; 4 1.905,-2.8; 5 1.905,2.8; 6 0.635,2.8; 7 -0.635,2.8; 8 -1.905,2.8
1X04 = drill 1.016 long: 1 -3.81,0; 2 -1.27,0; 3 1.27,0; 4 3.81,0
1X06 = drill 1.016 octagon: 1 -6.35,0; 2 -3.81,0; 3 -1.27,0; 4 1.27,0; 5 3.81,0; 6 6.35,0
JP1 = drill 0.914 long: 1 0,-1.27; 2 0,1.27
SMT-JUMPER_2_NC_TRACE_SILK = smd 0.635 x 1.27: 1 -0.508,0; 2 0.508,0
SMT-JUMPER_3_NO_SILK = smd 0.635 x 1.27: 1 -0.813,0; 2 0,0; 3 0.813,0
SMT-JUMPER_2_NO_SILK = smd 0.635 x 1.27: 1 -0.406,0; 2 0.406,0
1X03 = drill 1.016: 1 -2.54,0; 2 0,0; 3 2.54,0
R0603 = smd 0.889 x 0.889: 1 0,0.762; 2 0,-0.762
SOT23 = smd 1 x 1.4: 1 -0.95,-1.1; 2 0.95,-1.1; 3 0,1.1
R0603' = smd 1 x 1.1: 1 -0.85,0; 2 0.85,0
3362P = drill 0.813 pad 1.676 octagon: 1 -2.54,0; 2 0,2.54; 3 2.54,0
R0402 = smd 0.7 x 0.9: 1 -0.65,0; 2 0.65,0
R0805 = smd 1.3 x 1.5: 1 -0.95,0; 2 0.95,0
R1206 = smd 1.6 x 1.803: 1 -1.422,0; 2 1.422,0
R2010 = smd 1.8 x 2.7: 1 -2.2,0; 2 2.2,0
LPT80A = drill 0.813 octagon: C 0,-1.27; E 0,1.27
TP16R = smd 1.6 x 1.6: TP 0,0
IRL80A = drill 0.813 octagon: A 0,-1.27; K 0,1.27
QFN32G-0.5-5X5MM = smd 0.7 x 0.25: 1 -2.45,1.75; 2 -2.45,1.25; 3 -2.45,0.75; 4 -2.45,0.25; 5 -2.45,-0.25; 6 -2.45,-0.75; 7 -2.45,-1.25; 8 -2.45,-1.75; 17 2.45,-1.75; 18 2.45,-1.25; 19 2.45,-0.75; 20 2.45,-0.25; 21 2.45,0.25; 22 2.45,0.75; 23 2.45,1.25; 24 2.45,1.75 | smd 0.25 x 0.7: 9 -1.75,-2.45; 10 -1.25,-2.45; 11 -0.75,-2.45; 12 -0.25,-2.45; 13 0.25,-2.45; 14 0.75,-2.45; 15 1.25,-2.45; 16 1.75,-2.45; 25 1.75,2.45; 26 1.25,2.45; 27 0.75,2.45; 28 0.25,2.45; 29 -0.25,2.45; 30 -0.75,2.45; 31 -1.25,2.45; 32 -1.75,2.45 | smd 3.6 x 3.6: 33 0,0
VQFN-28 = smd 0.82 x 0.24: 1 -2,1.35; 2 -2,0.9; 3 -2,0.45; 4 -2,0; 5 -2,-0.45; 6 -2,-0.9; 7 -2,-1.35; 15 2,-1.35; 16 2,-0.9; 17 2,-0.45; 18 2,0; 19 2,0.45; 20 2,0.9; 21 2,1.35 | smd 0.24 x 0.82: 8 -1.35,-2; 9 -0.9,-2; 10 -0.45,-2; 11 0,-2; 12 0.45,-2; 13 0.9,-2; 14 1.35,-2; 22 1.35,2; 23 0.9,2; 24 0.45,2; 25 0,2; 26 -0.45,2; 27 -0.9,2; 28 -1.35,2 | smd 2.4 x 2.4: PAD 0,0

### Placement (x,y rotation side)
C1  30.32,40.48 0 top
C2  27.94,50.32 270 top
C3  26.19,43.02 180 top
C4  17.3,50.32 90 top
C5  30.32,27.46 0 top
C6  72.87,70.01 90 top
EXT1  29.53,67.79 270 top
EXT2  13.18,67.63 270 top
EXT3  29.53,22.23 90 top
EXT4  30.48,35.4 90 top
EXT5  97.95,33.66 90 top
EXT6  97.95,24.92 270 top
IC1  16.19,30.8 90 top
IC2  64.29,71.91 90 top
IC3  74.77,39.05 0 top
IC4  75.41,9.05 0 top
IC5  85.41,9.05 270 top
JP1  82.39,61.59 270 top
JP2  59.69,61.44 270 top
JP3  2.86,63.18 90 top
JP4  25.08,17.62 90 top
JP5  32.7,65.25 90 top
JP6  16.35,65.09 90 top
JP7  46.2,16.83 180 top
JP8  9.05,24.45 270 top
JP9  23.97,20.95 180 top
JP10  74.77,18.57 0 top
JP11  3.33,30.8 90 top
JP12  22.38,42.23 0 top
JP13  25.56,33.5 0 top
JP14  23.18,23.65 180 top
JP15  46.35,41.59 180 top
JP16  75.72,89.22 90 top
JP17  61.91,83.34 0 top
JP18  92.71,48.1 0 top
NTC1  47.15,67.63 180 top
NTC1->NTC2  22.38,71.12 90 top
NTC1_EN  28.1,71.12 270 top
NTC2  47.15,55.24 180 top
NTC2_CON1  27.62,80.33 180 top
NTC2_CON2  25.08,98.11 0 top
NTC2_CON3  9.84,80.33 180 top
NTC2_CON4  7.3,98.11 0 top
NTC2_CON5  42.86,98.11 0 top
NTC2_CON6  45.4,80.33 180 top
NTC2_CON7  68.42,90.01 90 top
NTC2_CON8  55.4,92.71 270 top
NTC2_EN  14.45,71.12 270 top
NTC3  46.99,22.86 0 top
NTC4  46.99,35.72 180 top
NTC5  26.35,95.57 270 top
NTC6  8.46,91.67 270 top
NTC7  44.13,91.76 90 top
NTC8  8.46,91.67 90 bottom
NTC9  44.13,91.76 270 bottom
NTC10  26.35,95.57 90 bottom
NTC11  63.5,91.6 180 bottom
NTC12  63.5,91.6 180 top
NTC13  60.33,91.6 0 bottom
NTC14  60.33,91.6 0 top
NTC15  96.2,85.41 90 top
NTC16  96.2,93.34 90 top
Q1  37.78,50.32 270 top
Q2  26.51,26.83 270 top
Q3  79.06,55.56 0 top
Q4  86.04,27.46 270 top
Q5  92.71,54.93 0 top
Q6  92.71,50.96 0 top
Q7  47.04,9.9 0 top
R1  [R0603']  25.08,50.32 90 top
R2  [R0603']  14.45,50.32 90 top
R3  [R0603']  14.76,24.77 0 top
R4  [R0603']  23.02,33.97 90 top
R5  84.14,85.41 180 top
R6  [R0603']  78.74,85.57 0 top
R7  13.18,58.1 270 top
R8  29.53,58.26 270 top
R9  35.56,22.7 0 top
R10  35.56,35.72 0 top
R11  [R0603']  22.23,50.32 270 top
R12  [R0603']  30.8,50.32 270 top
R13  84.14,93.34 180 top
R14  [R0603']  78.74,93.19 0 top
R15  [R0603']  36.2,17.94 0 top
R16  [R0603']  36.2,31.11 0 top
R17  [R0603']  23.02,30.32 90 top
R18  [R0603']  23.02,26.83 270 top
R19  18.26,19.21 180 top
R20  [R0603']  22.38,40.01 0 top
R21  [R0603']  26.04,36.83 0 top
R22  [R0603']  26.19,40.01 0 top
R23  9.53,19.21 180 top
R24  [R0603']  18.41,43.02 0 top
R25  9.21,40.32 180 top
R26  [R0603']  76.52,70.01 90 top
R27  [R0603']  63.5,60.17 0 top
R28  [R0603']  63.5,63.5 0 top
R29  [R0603']  70.17,70.01 90 top
R30  64.93,50.96 180 top
R31  1k  [R0603']  64.45,55.56 180 top
R32  72.55,50.96 180 top
R33  [R0603']  85.88,19.84 180 top
R34  [R0603']  85.88,30.8 180 top
R35  91.28,22.38 270 top
R36  91.28,33.34 270 top
R37  [R0603']  85.88,33.66 0 top
R38  [R0603']  85.88,22.86 0 top
R39  [R0603']  81.6,22.86 0 top
R40  [R0603']  81.6,33.81 0 top
R41  [R0603']  77.15,22.86 0 top
R42  [R0603']  68.26,26.19 180 top
R43  [R0603']  77.15,28.42 180 top
R44  [R0603']  81.6,28.42 0 top
R45  62.87,25.4 90 top
R46  [R0603']  91.76,27.78 180 top
R47  [R0603']  68.26,32.54 180 top
R48  [R0603']  72.07,28.42 180 top
R49  62.87,33.18 270 top
R50  [R0603']  61.73,38.73 180 top
R51  [R0603']  68.26,29.37 0 top
R52  9.53,9.68 90 top
R53  [R0603']  11.11,9.68 90 top
R54  13.18,9.68 90 top
R55  15.24,9.68 90 top
R57  17.94,9.68 90 top
RX  79.38,49.05 240 bottom
TP1  32.07,53.18 0 top
TP2  34.92,61.12 0 top
TP3  18.57,60.96 0 top
TP4  32.7,67.79 0 top
TP5  16.35,67.63 0 top
TP6  17.46,24.13 0 top
TP7  18.57,37.62 0 top
TP8  40.16,22.7 90 top
TP9  40.16,36.99 0 top
TP10  4.45,39.69 0 top
TP11  2.54,91.76 0 bottom
TP12  32.07,91.76 0 top
TP13  20.32,91.76 0 top
TP14  2.54,91.76 0 top
TP15  14.29,91.76 0 top
TP16  49.85,91.76 0 top
TP17  38.1,91.76 0 top
TP18  14.29,91.76 0 bottom
TP19  80,21 0 top
TP20  46.99,29.53 90 top
TP21  24.92,29.69 0 top
TP22  68.42,87.15 0 top
TP23  68.42,95.25 0 top
TP24  55.24,95.41 90 top
TP25  55.09,87.15 0 top
TP26  85.14,37.13 0 top
TP27  69.58,23.61 0 top
TP28  33.66,18.1 0 top
TP29  33.66,31.11 0 top
TP30  76.25,26.27 0 top
TP31  86.41,24.82 0 top
TP32  67.99,36.05 0 top
TX  79.22,74.14 120 bottom
U1  65.56,9.21 0 top
U2  55.09,9.21 0 top

### Tracks (layer width: path | path; a pad name or v marks a point on that pad's centre or on a via)
AVSS  (1 unrouted)
GND  (via drill 3 pad 0.6)  (3 unrouted)
  Top 0.406: RX.E 78.28,45.27 78,45 | v2.86,42.86 5,45.01 5,48 | v54.13,17.46 v60.48,17.46
  other vias: 2.86,74.61 54.13,74.61 2.86,49.21 54.13,49.21 54.13,42.86 2.86,17.46 60.48,42.86 97.16,42.86 97.16,17.46
  pour Top: 0.32,77.15 56.67,77.15 56.67,46.67 0.32,46.67
  pour Bottom: 0.32,77.15 56.67,77.15 56.67,46.67 0.32,46.67
  pour Bottom: 0.32,45.4 56.67,45.4 56.67,14.92 0.32,14.92
  pour Top: 0.32,45.4 56.67,45.4 56.67,14.92 0.32,14.92
  pour Top: 57.94,77.15 84.14,77.15 84.14,46.67 57.94,46.67
  pour Bottom: 57.94,77.15 84.14,77.15 84.14,46.67 57.94,46.67
  pour Top: 57.94,45.4 99.85,45.4 99.85,14.92 57.94,14.92
  pour Bottom: 57.94,45.4 99.69,45.4 99.69,14.92 57.94,14.92
HEATER_EN  (via drill 0.6 pad 0.6)
  Top 0.406: v18.89,49.53 arc90 19.05,49.37 22.12,49.37 arc90 R11.2
  Bottom 0.406: JP3.4 9.37,64.45 arc-90 10,63.82 10,53.66 arc90 11.91,51.75 16.67,51.75 arc-90 v18.89,49.53
N$1  (via drill 0.6 pad 0.55)
  Top 0.406: IC1.10 12.06,32.07 arc-90 11.59,32.54 v11.59,33.34
  Bottom 0.406: v11.59,33.34 11.59,36.99 arc90 10.79,37.78 R25.2
N$2
  Top 0.406: R9.3 arc90 35.34,19.95 R15.1 35.19,18.1 TP28.TP
N$3
  Top 0.406: R10.3 arc-90 36.67,34.29 arc90 35.34,32.96 R16.1 TP29.TP
N$4
  Top 0.406: R1.2 25.08,54.77 arc-90 26.04,55.72 R8.3
N$5
  Top 0.406: R26.1 78.26,69.16 | 78.26,69.16 81.65,69.16 arc-90 82.39,68.42 JP1.1 | TX.A 78.12,69.31 arc90 78.26,69.16
N$6
  Top 0.406: JP7.1 46.99,16.83 NTC3.2
N$7  (via drill 0.6 pad 0.6)
  Top 0.406: TP1.TP 31.11,53.18 arc90 30.8,52.86 30.8,52.55 | 30.8,52.55 R12.1 arc-90 30.9,51.27 Q1.1 | R11.1 22.23,51.28 arc-90 v23.5,52.55 | v29.53,52.55 30.8,52.55
  Bottom 0.406: v23.5,52.55 26.35,52.55 arc-90 26.67,52.23 arc90 26.99,51.91 28.89,51.91 arc90 v29.53,52.55
N$8
  Top 0.406: JP16.4 arc-90 76.04,90.81 R13.2 86.2,90.81 88.74,93.34 NTC16.1
N$9
  Top 0.406: R2.2 14.45,52.7 arc90 13.81,53.34 arc-90 13.18,53.98 R7.3
N$10
  Top 0.406: Q3.3 79.06,61.75 80.17,62.87 JP1.2
  Bottom 0.406: TX.K 80.16,73.34 80.16,63.51 80.8,62.87 JP1.2
N$11
  Top 0.406: NTC4.1 TP20.TP | NTC3.1 TP20.TP | 27.77,23.65 27.77,26.67 arc-90 Q2.3 27.77,26.99 27.77,29.53 | JP14.1 27.77,23.65 | TP20.TP 27.77,29.53 | EXT4.1 28.42,35.4 arc90 27.77,34.76 27.77,29.53 | EXT3.1 28.42,22.23 arc-90 27.78,22.86 | 27.78,22.86 27.78,23.64 arc90 27.77,23.65 | JP9.1 25.88,20.95 arc90 27.78,22.86
N$12
  Top 0.406: R17.1 R18.1 arc-90 23.12,27.78 Q2.1 arc-90 24.92,28.27 TP21.TP
N$13  (via drill 0.6 pad 0.55)
  Top 0.305: v21.59,31.59 21.59,33.5 arc-90 22.07,33.97 24.68,33.97 arc-90 JP13.1
  Top 0.406: R17.2 22.01,31.17 arc-90 v21.59,31.59 | IC1.1 arc90 18.1,26.29 18.1,25.72 arc90 18.41,25.4 v19.05,25.4 19.05,21.43 19.53,20.95 JP9.3
  Bottom 0.406: v21.59,31.59 arc90 22.07,31.11 22.23,31.11 arc-90 22.7,30.64 22.7,26.83 arc-90 21.27,25.4 v19.05,25.4
N$14
  Top 0.406: R4.2 22.86,34.82 | 22.86,34.82 21.65,34.82 arc90 20.95,34.13 20.95,32.7 arc-90 20.32,32.07 IC1.5 | R21.1 25.18,35.34 arc-90 24.61,34.77 22.92,34.77 arc-90 22.86,34.82
N$15
  Top 0.406: 21.75,44.61 7.78,44.61 arc90 6.67,43.5 R25.3 6.67,39.69 TP10.TP | 21.75,44.61 arc-90 21.91,44.45 21.91,42.3 arc90 JP12.1 | 21.75,44.61 24.61,44.61 arc-90 25.34,43.87 C3.2 25.34,42.44 arc90 26.19,41.59 26.51,41.59 arc-90 27.15,40.96 27.15,40.11 arc-90 R22.2
N$16
  Top 0.406: R20.1 17.78,40.01 arc90 16.83,39.05 16.83,33.34 | R3.2 arc-90 15.4,24.98 15.4,28.42 arc90 16.51,29.53 16.51,29.69 arc90 15.56,30.64 15.4,30.64 15.4,32.7 16.83,32.7 16.83,33.34 | IC1.6 16.83,33.34
N$17  (via drill 0.6 pad 0.55)
  Top 0.406: R3.1 13.91,23.71 arc90 14.29,23.34 15.72,23.34 arc-90 16.19,22.86 arc90 16.67,22.38 v17.62,22.38 17.62,24.13 TP6.TP
  Bottom 0.406: R19.2 18.26,21.75 arc90 v17.62,22.38
N$18  (via drill 0.6 pad 0.55)
  Top 0.406: R24.1 arc90 16.03,41.49 16.03,37.47 | 16.03,37.47 16.03,34.29 arc-90 15.08,33.34 IC1.9 | v14.29,37.47 16.03,37.47
  Bottom 0.406: R23.2 9.53,21.11 arc90 8.26,22.38 7.14,22.38 arc-90 5.87,23.65 5.87,27.78 arc-90 7.14,29.05 12.06,29.05 arc90 13.49,30.48 13.49,36.67 arc-90 v14.29,37.47
N$19  (via drill 0.6 pad 0.55)
  Top 0.406: v15.4,29.53 IC1.12 | IC1.2 20.16,28.26 arc-90 20.8,27.62 v20.8,24.13 | EXT3.2 arc90 31.17,26.41 C5.2 34.92,27.46 arc-90 35.56,26.83 R9.2 arc90 36.35,24.45 39.37,24.45 arc-90 40.16,23.65 TP8.TP 40.16,17.78 arc90 41.12,16.83 JP7.2
  Bottom 0.406: EXT3.2 24.77,24.77 arc-90 23.65,25.88 23.65,30.96 arc90 21.59,33.02 21.43,33.02 arc90 19.84,31.43 19.84,29.84 arc-90 18.89,28.89 16.03,28.89 arc-90 v15.4,29.53 | v20.8,24.13 22.7,24.13 arc-90 23.5,23.34 23.5,21.59 arc90 24.61,20.48 33.34,20.48 arc90 34.45,21.59 34.45,24.13 arc-90 R9.2
N$20
  Top 0.406: IC1.8 10.64,34.61 arc90 9.84,33.81 9.84,30.16 arc-90 9.21,29.53 JP11.2 1.75,29.53 arc90 1.11,28.89 1.11,23.5 arc90 2.22,22.38 8.26,22.38 arc-90 9.53,21.11 9.53,20.64 arc90 10.95,19.21 R23.1
N$21  (via drill 0.6 pad 0.55)
  Top 0.406: IC1.3 17.62,29.53 arc-90 17.3,29.84 17.3,30.8 arc90 v16.51,31.59 | EXT4.2 arc90 31.17,38.63 C1.2 34.77,40.48 arc-90 35.56,39.69 R10.2 arc90 36.51,37.31 39.85,37.31 arc-90 TP9.TP 40.16,40.8 arc-90 40.96,41.59 JP15.2
  Bottom 0.406: v16.51,31.59 18.26,31.59 arc90 19.21,32.54 19.21,38.1 arc-90 20.64,39.53 34.29,39.53 arc-90 R10.2
N$22
  Top 0.203: JP5.1 arc90 33.78,63.66 39.05,63.66 arc90 40.32,64.93 40.32,72.71 arc-90 41.27,73.66 46.2,73.66 arc-90 47.15,72.71 NTC1.2
N$23  (via drill 0.6 pad 0.6)
  Top 0.203: JP6.1 16.35,64.45 arc90 17.94,62.87 v25.24,62.87 | v41.75,55.88 47.15,55.88 NTC2.2
  Bottom 0.203: v25.24,62.87 37.47,62.87 arc-90 38.58,61.75 38.58,56.67 arc90 39.37,55.88 v41.75,55.88
N$24  (via drill 0.6)
  Top 0.406: R26.2 76.52,71.91 IC2.4 65.25,71.91 arc-90 v64.77,72.39 | JP2.4 64.77,57.63 arc90 v65.09,57.94
  Bottom 0.406: v65.09,57.94 64.61,58.42 64.61,72.23 v64.77,72.39
N$25  (via drill 0.6 pad 0.55)
  Top 0.406: v21.11,30.32 arc90 20.64,30.8 IC1.4
  Bottom 0.406: JP8.1 7.78,26.67 arc-90 8.89,27.78 20.16,27.78 arc90 21.11,28.73 v21.11,30.32
N$26  (via drill 0.6 pad 0.55)
  Top 0.203: NTC12.2 64.01,92.36 arc-90 64.29,92.08 64.29,84.77 arc90 JP17.4 65.72,85.41 arc90 v65.09,86.04
  Top 0.406: NTC2_CON7.1 TP22.TP 68.42,86.04 arc-90 JP17.4
  Bottom 0.203: NTC12.2 64.01,92.36 arc-90 64.29,92.08 64.29,86.84 arc90 v65.09,86.04
N$27  (via drill 0.6 pad 0.55)
  Top 0.406: JP4.1 arc90 27.46,16.51 36.35,16.51 arc90 37.05,17.2 R15.2 arc-90 36.99,18 v36.99,20.48 | v36.83,32.86 arc-90 37.05,32.65 R16.2 | JP13.2 arc-90 26.67,32.79 v26.67,29.53
  Bottom 0.406: v36.99,20.48 arc-90 36.51,20.95 36.51,23.5 arc-90 37.47,24.45 arc90 38.42,25.4 38.42,32.23 arc90 37.78,32.86 v36.83,32.86 32.23,32.86 arc90 30.8,31.43 arc-90 28.89,29.53 v26.67,29.53
N$28
  Top 0.406: R20.2 R22.1 | R20.2 23.23,37.84 arc-90 21.91,36.51 18.79,36.51 | JP12.2 arc-90 23.23,41.78 R20.2 | 18.79,36.51 18.79,37.62 TP7.TP | 18.79,36.51 IC1.7
N$29
  Top 0.406: EXT2.1 TP5.TP | JP6.2 TP5.TP | NTC2_EN.2 arc-90 16.35,70.48 TP5.TP
N$30
  Top 0.203: NTC12.1 63.5,83.66 arc-90 JP17.3
  Top 0.406: TP23.TP NTC2_CON7.2
  Bottom 0.203: NTC12.1 63.5,83.66 arc-90 JP17.3 arc-90 65.09,85.25 66.52,85.25 arc90 67.79,86.52 67.79,88.11 arc90 67.63,88.27 67.15,88.27 arc-90 66.99,88.42 66.99,91.6 arc-90 67.94,92.55 NTC2_CON7.2
N$31
  Top 0.406: JP5.2 TP4.TP | EXT1.1 TP4.TP | NTC1_EN.2 31.43,71.12 arc-90 32.7,69.85 TP4.TP
N$32
  Top 0.406: JP15.1 46.99,41.59 NTC4.2
N$33
  Top 0.203: NTC14.2 60.33,83.66 arc90 JP17.2
  Top 0.406: TP24.TP 55.24,92.87 arc90 NTC2_CON8.1
  Bottom 0.203: NTC2_CON8.1 arc-90 56.83,91.28 56.83,88.42 arc-90 56.67,88.27 56.04,88.27 arc90 55.88,88.11 55.88,86.68 arc90 57.31,85.25 58.74,85.25 arc-90 JP17.2 arc-90 60.33,83.66 NTC14.2
N$34  (via drill 0.6 pad 0.55)
  Top 0.203: NTC14.1 59.82,92.36 arc90 59.53,92.08 59.53,84.77 arc-90 JP17.1 58.1,85.41 arc-90 v58.74,86.04
  Top 0.406: NTC2_CON8.2 arc90 55.09,89.85 TP25.TP 55.09,86.36 arc90 JP17.1
  Bottom 0.203: NTC14.1 59.82,92.36 arc90 59.53,92.08 59.53,86.84 arc-90 v58.74,86.04
N$35
  Top 0.406: R33.1 R35.3
N$36
  Top 0.406: NTC16.2 96.01,94.3 88.58,94.3 87.31,95.57 JP16.6
N$37
  Top 0.406: NTC15.2 96.01,86.36 88.58,86.36 87,87.95 JP16.3
N$38  (via drill 0.6)
  Top 0.406: R28.1 62.65,62.92 arc90 63.5,62.07 arc-90 64.35,61.22 R27.2 64.35,59.95 66.52,57.78 66.52,54.77 67.94,53.34 v68.74,53.34 76.98,53.34 arc90 Q3.1
N$39
  Top 0.406: R27.1 JP2.3
N$40
  Top 0.406: R5.3 81.44,85.57 R6.2
N$41
  Top 0.406: R13.3 81.44,93.19 R14.2
N$42
  Top 0.406: JP16.1 R5.2 86.2,82.87 88.74,85.41 NTC15.1
N$43  (via drill 0.6)
  Top 0.406: IC2.1 68.32,68.1 69.37,69.16 R29.1 C6.1 75.03,69.16 arc90 v75.09,69.22 | IC2.5 v68.9,73.18
  Bottom 0.406: v68.9,73.18 arc90 69.06,73.03 74.61,73.03 arc-90 75.09,72.55 v75.09,69.22
N$44
  Top 0.406: R6.1 77.73,85.41 JP16.2
N$45
  Top 0.406: R14.1 77.73,93.03 JP16.5
N$46  (via drill 0.6)
  Top 0.406: IC2.2 67.94,69.37 69.43,70.86 R29.2 C6.2 73.92,70.86 v74.14,70.64
  Bottom 0.406: RX.C 82.39,51.6 JP1.4 80.96,57.78 79.22,59.53 79.22,67.94 78.9,68.26 74.61,68.26 74.14,68.74 v74.14,70.64
N$47  (via drill 0.6)
  Top 0.406: R30.2 64.93,54.24 64.03,54.24 arc-90 63.66,54.61 63.66,55.51 arc90 R31.2 | IC2.6 64.77,74.45 arc90 63.82,73.5 63.82,65.56 arc-90 63.5,65.25 v62.39,65.25
  Bottom 0.406: v62.39,65.25 arc-90 63.02,64.61 63.02,53.02 arc90 64.45,51.59 arc-90 64.93,51.12 R30.2
N$48  (via drill 0.6)
  Top 0.406: R32.3 R30.1 | IC2.7 v64.61,75.72
  Bottom 0.406: v64.61,75.72 63.82,74.93 63.82,53.5 arc90 64.93,52.39 65.25,52.39 arc-90 65.88,51.75 65.88,51.59 arc90 66.52,50.96 R30.1
N$49  (via drill 0.6)
  Top 0.406: R32.2 67.63,48.42 arc90 66.67,47.47 arc-90 66.36,47.15 61.12,47.15 arc-90 60.8,47.47 60.8,54.45 v61.44,55.09
  Bottom 0.406: v61.44,55.09 62.23,55.88 62.23,61.75 61.28,62.71 JP2.2
N$50
  Top 0.406: R36.3 R34.1
N$51  (via drill 0.6)
  Top 0.406: R4.1 24.71,31.43 v25.56,31.43 | v31.27,23.5 31.27,20.32 arc-90 30.64,19.68 24.45,19.68 arc-90 23.97,20.16 JP9.2
  Bottom 0.406: v25.56,31.43 25.56,27.78 arc90 26.83,26.51 30.64,26.51 arc-90 31.75,25.4 31.75,23.97 arc-90 v31.27,23.5
N$52
  Top 0.406: EXT6.2 R35.2 91.12,22.38 90.65,22.86 R38.2 86.73,22.28 85.72,21.27 80.27,21.27 TP19.TP
N$53
  Top 0.305: TP26.TP 86.73,35.54 R37.2
  Top 0.406: EXT5.2 94.61,36.2 93.82,35.4 R36.2 91.12,33.34 90.81,33.66 R37.2
N$54
  Top 0.305: TP31.TP 86.41,26.73 Q4.3
  Top 0.406: Q4.3 90.59,27.46 R46.2 | EXT5.1 97.95,30.48 96.68,29.21 91.44,29.21 90.91,28.68 R46.2 | EXT6.1 97.95,25.08 96.68,26.35 91.6,26.35 90.91,27.04 R46.2
N$55
  Top 0.406: R37.1 82.61,33.66 R40.2 82.39,33.87 82.39,37.31 81.6,38.1 73.82,38.1 73.5,37.78 IC3.3
N$56  (via drill 0.6)
  Top 0.406: R38.1 R39.2 82.45,24.23 81.92,24.77 v80.49,24.77 | IC3.2 72.23,33.81 v74.14,31.91
  Bottom 0.406: v74.14,31.91 75.09,30.96 75.09,26.19 76.52,24.77 v80.49,24.77
N$57
  Top 0.406: R42.1 73.82,26.19 | 73.82,26.19 74.61,26.99 74.61,27.94 75.09,28.42 R43.2 76.3,30.42 77.31,31.43 IC3.6 | R41.1 75.09,22.86 74.61,23.34 74.61,25.4 73.82,26.19
N$58  (via drill 0.6)
  Top 0.406: R39.1 79.38,22.86 | 79.38,22.86 R41.2 | IC3.1 70.96,33.5 v72.87,31.59 | v79.38,23.81 79.38,22.86
  Bottom 0.406: v72.87,31.59 74.3,30.16 74.3,25.72 76.2,23.81 v79.38,23.81
N$59
  Top 0.406: R44.2 Q4.1
N$60
  Top 0.305: TP30.TP 77.39,26.27 77.95,26.83 77.95,28.47
  Top 0.406: R44.1 R43.1 77.95,28.47 77.95,30.16 78.58,30.8 IC3.7
N$61
  Top 0.406: R50.1 62.87,38.45 R49.1
N$62
  Top 0.305: TP27.TP 68.15,23.61 67.41,24.34 R42.2
  Top 0.406: R45.2 63.5,25.4 64.29,26.19 R42.2
N$63  (via drill 0.6)
  Top 0.406: R48.2 71.22,31.96 70.64,32.54 70.17,32.54 | 70.17,32.54 R47.1 | IC3.9 77.31,38.89 | 77.31,38.89 70.96,38.89 70.17,38.1 70.17,32.54 | R46.1 v97.95,27.78 | v82.55,38.89 77.31,38.89
  Bottom 0.406: v97.95,27.78 97.95,29.37 95.57,31.75 95.57,37.15 93.82,38.89 v82.55,38.89
N$64
  Top 0.406: R49.3 63.02,30.48 65.56,30.48 66.67,29.37 R51.1
N$65
  Top 0.305: Q5.3 Q6.3 JP18.2
N$66
  Top 0.406: R47.2 66.78,33.18 R49.2 65.41,35.56 66.04,36.2 67.85,36.2 TP32.TP
N$67  (via drill 0.6)
  Top 0.406: IC3.8 79.85,40.38 v79.85,40.01 | v72.71,30.16 72.92,29.95 R48.1
  Bottom 0.406: v79.85,40.01 79.85,34.13 78.74,33.02 72.71,33.02 71.75,32.07 71.75,30.64 72.23,30.16 v72.71,30.16 73.5,29.37 JP10.2
N$68
  Top 0.305: Q5.2 Q6.2 93.66,49.69 arc90 JP18.3
N$69
  Top 0.305: Q5.1 Q6.1 91.76,49.69 arc-90 JP18.1
N$70
  Top 0.152: 1,0 1,4
N$71
  Top 0.152: 2,0 2,4
N$72
  Top 0.152: 3,0 3,4
N$73
  Top 0.152: 4,0 4,4
N$74
  Top 0.152: 5,0 5,5
N$75
  Top 0.152: 6,0 6,4
N$76
  Top 0.152: 7,0 7,4
N$77
  Top 0.152: 8,0 8,4
N$78
  Top 0.152: 9,0 9,4
N$79
  Top 0.152: 10,0 10,5
N$80
  Top 0.152: 11,0 11,4
N$81
  Top 0.152: 12,0 12,4
N$82
  Top 0.152: 13,0 13,4
N$83
  Top 0.152: 14,0 14,4
N$84
  Top 0.152: 15,0 15,5
N$85
  Top 0.152: 16,0 16,4
N$86
  Top 0.152: 17,0 17,4
N$87
  Top 0.152: 18,0 18,4
N$88
  Top 0.152: 19,0 19,4
N$89
  Top 0.152: 20,0 20,5
N$90
  Top 0.152: 21,0 21,4
N$91
  Top 0.152: 22,0 22,4
N$92
  Top 0.152: 23,0 23,4
N$93
  Top 0.152: 24,0 24,4
N$94
  Top 0.152: 25,0 25,5
N$95
  Top 0.152: 26,0 26,4
N$96
  Top 0.152: 27,0 27,4
N$97
  Top 0.152: 28,0 28,4
N$98
  Top 0.152: 29,0 29,4
N$99
  Top 0.152: 30,0 30,5
N$100
  Top 0.152: 31,0 31,4
N$101
  Top 0.152: 32,0 32,4
N$102
  Top 0.152: 33,0 33,4
N$103
  Top 0.152: 34,0 34,4
N$104
  Top 0.152: 35,0 35,5
N$105
  Top 0.152: 36,0 36,4
N$106
  Top 0.152: 37,0 37,4
N$107
  Top 0.152: 38,0 38,4
N$108
  Top 0.152: 39,0 39,4
N$109
  Top 0.152: 40,0 40,5
N$110
  Top 0.152: 41,0 41,4
N$111
  Top 0.152: 42,0 42,4
N$112
  Top 0.152: 43,0 43,4
N$113
  Top 0.152: 44,0 44,4
N$114
  Top 0.152: 45,0 45,5
N$115
  Top 0.152: 46,0 46,4
N$116
  Top 0.152: 47,0 47,4
N$117
  Top 0.152: 48,0 48,4
N$118
  Top 0.152: 49,0 49,4
N$119
  Top 0.152: 50,0 50,5
N$120
  Top 0.152: 51,0 51,4
N$121
  Top 0.152: 52,0 52,4
N$122
  Top 0.152: 53,0 53,4
N$123
  Top 0.152: 54,0 54,4
N$124
  Top 0.152: 55,0 55,5
N$125
  Top 0.152: 56,0 56,4
N$126
  Top 0.152: 57,0 57,4
N$127
  Top 0.152: 58,0 58,4
N$128
  Top 0.152: 59,0 59,4
N$129
  Top 0.152: 60,0 60,5
N$130
  Top 0.152: 61,0 61,4
N$131
  Top 0.152: 62,0 62,4
N$132
  Top 0.152: 63,0 63,4
N$133
  Top 0.152: 64,0 64,4
N$134
  Top 0.152: 65,0 65,5
N$135
  Top 0.152: 66,0 66,4
N$136
  Top 0.152: 67,0 67,4
N$137
  Top 0.152: 68,0 68,4
N$138
  Top 0.152: 69,0 69,4
N$139
  Top 0.152: 70,0 70,5
N$140
  Top 0.152: 71,0 71,4
N$141
  Top 0.152: 72,0 72,4
N$142
  Top 0.152: 73,0 73,4
N$143
  Top 0.152: 74,0 74,4
N$144
  Top 0.152: 75,0 75,5
N$145
  Top 0.152: 76,0 76,4
N$146
  Top 0.152: 77,0 77,4
N$147
  Top 0.152: 78,0 78,4
N$148
  Top 0.152: 79,0 79,4
N$149
  Top 0.152: 80,0 80,5
N$150
  Top 0.152: 81,0 81,4
N$151
  Top 0.152: 82,0 82,4
N$152
  Top 0.152: 83,0 83,4
N$153
  Top 0.152: 84,0 84,4
N$154
  Top 0.152: 85,0 85,5
N$155
  Top 0.152: 86,0 86,4
N$156
  Top 0.152: 87,0 87,4
N$157
  Top 0.152: 88,0 88,4
N$158
  Top 0.152: 89,0 89,4
N$159
  Top 0.152: 90,0 90,5
N$160
  Top 0.152: 91,0 91,4
N$161
  Top 0.152: 92,0 92,4
N$162
  Top 0.152: 93,0 93,4
N$163
  Top 0.152: 94,0 94,4
N$164
  Top 0.152: 95,0 95,5
N$165
  Top 0.152: 96,0 96,4
N$166
  Top 0.152: 97,0 97,4
N$167
  Top 0.152: 98,0 98,4
N$168
  Top 0.152: 99,0 99,4
N$169
  Top 0.152: 100,0 100,5
N$170
  Top 0.152: 0,0 0,5
NTC1_EN
  Top 0.406: NTC1_EN.1 NTC1->NTC2.1 23.65,71.91 arc90 21.27,74.3 12.06,74.3 arc90 9.53,71.75 arc-90 8.26,70.48 3.81,70.48 arc90 JP3.6
NTC1_OUT  (via drill 0.6 pad 0.6)
  Top 0.203: NTC1.1 47.15,62.23 arc-90 46.04,61.12 36.51,61.12
  Top 0.406: v26.83,53.5 27.94,52.39 C2.1 | TP2.TP 36.51,61.12 | EXT1.2 arc-90 30.8,63.98 30.8,61.91 arc90 31.59,61.12 TP2.TP | TP2.TP 34.92,58.26 | 34.92,58.26 R8.2 | 34.92,58.26 34.92,56.67 arc90 37.15,54.45 arc-90 38.88,52.72 Q1.3
  Bottom 0.406: R8.2 32.07,56.36 arc-90 29.21,53.5 v26.83,53.5 19.37,53.5 arc-90 17.62,55.24 17.62,61.59 arc90 16.03,63.18 12.86,63.18 arc-90 11.27,64.77 11.27,66.04 arc90 10.32,66.99 JP3.5
NTC2_EN
  Top 0.406: NTC1->NTC2.2 arc90 18.89,73.34 14.76,73.34 arc90 13.49,72.07 13.49,71.44 arc-90 NTC2_EN.1 12.22,71.12 arc90 11.27,70.17 11.27,63.18 arc-90 10,61.91 JP3.3
NTC2_OUT  (via drill 0.6 pad 0.6)
  Top 0.203: NTC2.1 41.94,54.48 arc90 v41.75,54.29 | v25.24,59.37 20.16,59.37
  Top 0.406: C4.2 arc-90 15.72,52.76 v15.72,53.02 R7.2 | JP3.2 8.1,59.37 arc-90 8.73,58.74 arc90 9.37,58.1 R7.2 | EXT2.2 13.18,62.87 arc90 13.81,62.23 17.3,62.23 arc-90 TP3.TP arc-90 20.16,59.37 arc-90 18.89,58.1 R7.2
  Bottom 0.203: v41.75,54.29 38.73,54.29 arc-90 37.62,55.4 37.62,61.91 26.19,61.91 arc90 25.24,60.96 v25.24,59.37
P1_H
  pour Top: 26.04,78.42 18.1,78.42 18.1,99.69 26.04,99.69
  pour Bottom: 18.1,99.69 26.04,99.69 26.04,78.42 18.1,78.42
P1_L
  pour Top: 26.67,99.69 34.61,99.69 34.61,78.42 26.67,78.42
  pour Bottom: 26.67,99.69 34.61,99.69 34.61,78.42 26.67,78.42
P2_H
  Bottom 0.203: NTC8.2 3.81,91.67
  pour Bottom: 0.32,99.69 8.26,99.69 8.26,78.42 0.32,78.42
P2_L
  Bottom 0.203: NTC8.1 13.97,91.67 | 13.97,91.67 14.13,91.67 | TP18.TP 14.06,91.76 13.97,91.67
  pour Bottom: 8.89,99.69 16.83,99.69 16.83,78.42 8.89,78.42
P3_H
  pour Top: 44.45,99.69 52.39,99.69 52.39,78.42 44.45,78.42
  pour Bottom: 44.45,99.69 52.39,99.69 52.39,78.42 44.45,78.42
P3_L
  pour Top: 43.81,78.42 35.88,78.42 35.88,99.69 43.81,99.69
  pour Bottom: 35.88,99.69 43.81,99.69 43.81,78.42 35.88,78.42
P5_H
  Top 0.203: NTC6.2 2.63,91.67 TP14.TP
  pour Top: 8.26,78.42 0.32,78.42 0.32,99.69 8.26,99.69
P5_L
  Top 0.203: NTC6.1 14.2,91.67 TP15.TP
  pour Top: 16.83,78.42 8.89,78.42 8.89,99.69 16.83,99.69
TEMP  (via drill 0.6 pad 0.55)
  Top 0.406: v11.27,30.64 11.27,28.89 arc90 11.91,28.26 IC1.13 IC1.14
  Bottom 0.406: JP11.3 5.08,32.07 arc-90 6.03,31.11 arc90 6.99,30.16 10.79,30.16 arc90 v11.27,30.64
VCC
  Top 0.406: JP11.1 10,26.99 arc-90 10.32,26.67 JP8.2 10.32,23.34 arc90 11.59,22.07 14.76,22.07 arc-90 15.72,21.11 R19.3 18.26,19.21 20,17.46 23.65,17.46 JP4.2
VCC_1  (via drill 0.6)
  Top 0.406: v82.71,20.16 81.76,20.16 80.17,18.57 JP10.4 78.58,20.32 78.26,20.64 69.53,20.64 67.31,22.86 R45.1 60.33,22.86 58.9,24.29 58.9,37.47 60.17,38.73 R50.2 | v82.39,26.67 84.79,26.67 Q4.2
  Bottom 0.406: v82.71,20.16 83.03,20.48 83.03,26.04 v82.39,26.67
VCCA  (via drill 0.6)
  Top 0.406: R51.2 69.11,28.47 68.58,27.94 R45.3 | v83.98,18.26 85.03,19.31 R33.2 | v83.5,30.8 R34.2 | v75.72,31.91 74.77,32.86 IC3.4
  Bottom 0.406: R45.3 67.63,27.94 68.74,26.83 68.74,20.8 JP10.1 70.96,17.14 71.6,16.51 80.33,16.51 82.07,18.26 v83.98,18.26 83.98,30.32 v83.5,30.8 76.83,30.8 v75.72,31.91
VDDC  (1 unrouted)
VDDIO  (2 unrouted)
VSSC  (1 unrouted)
VSSIO  (2 unrouted)

### Text on the board
tPlace: 1 | 2 | 3 | 4 | 5 | 6 | 7 | 8 | 9
tNames: PROBE5 | PROBE1 | PROBE2 | PROBE3 | PROBE4 | CURRENT | Digital Anemometer | FLOW | NTC1 | OUT1 | HEATER | NTC2 | OUT2 | AMBIENT | GND | Analog Anemometer | FLOW | GND | TEMP | WIND | AMBIENT | VCC